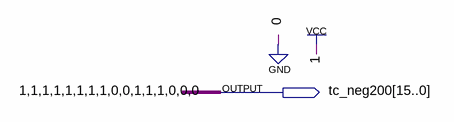
[diagram p0: schematic sheet]
// Quartus schematic tc_neg200.bdf as structural Verilog: 0 symbols, 1 pins
module tc_neg200 (
  output [15:0] tc_neg200
);


  assign tc_neg200 = 16'b1111111100111000;
endmodule
